# Altium schematic sheet Sheet.SchDoc
size A4
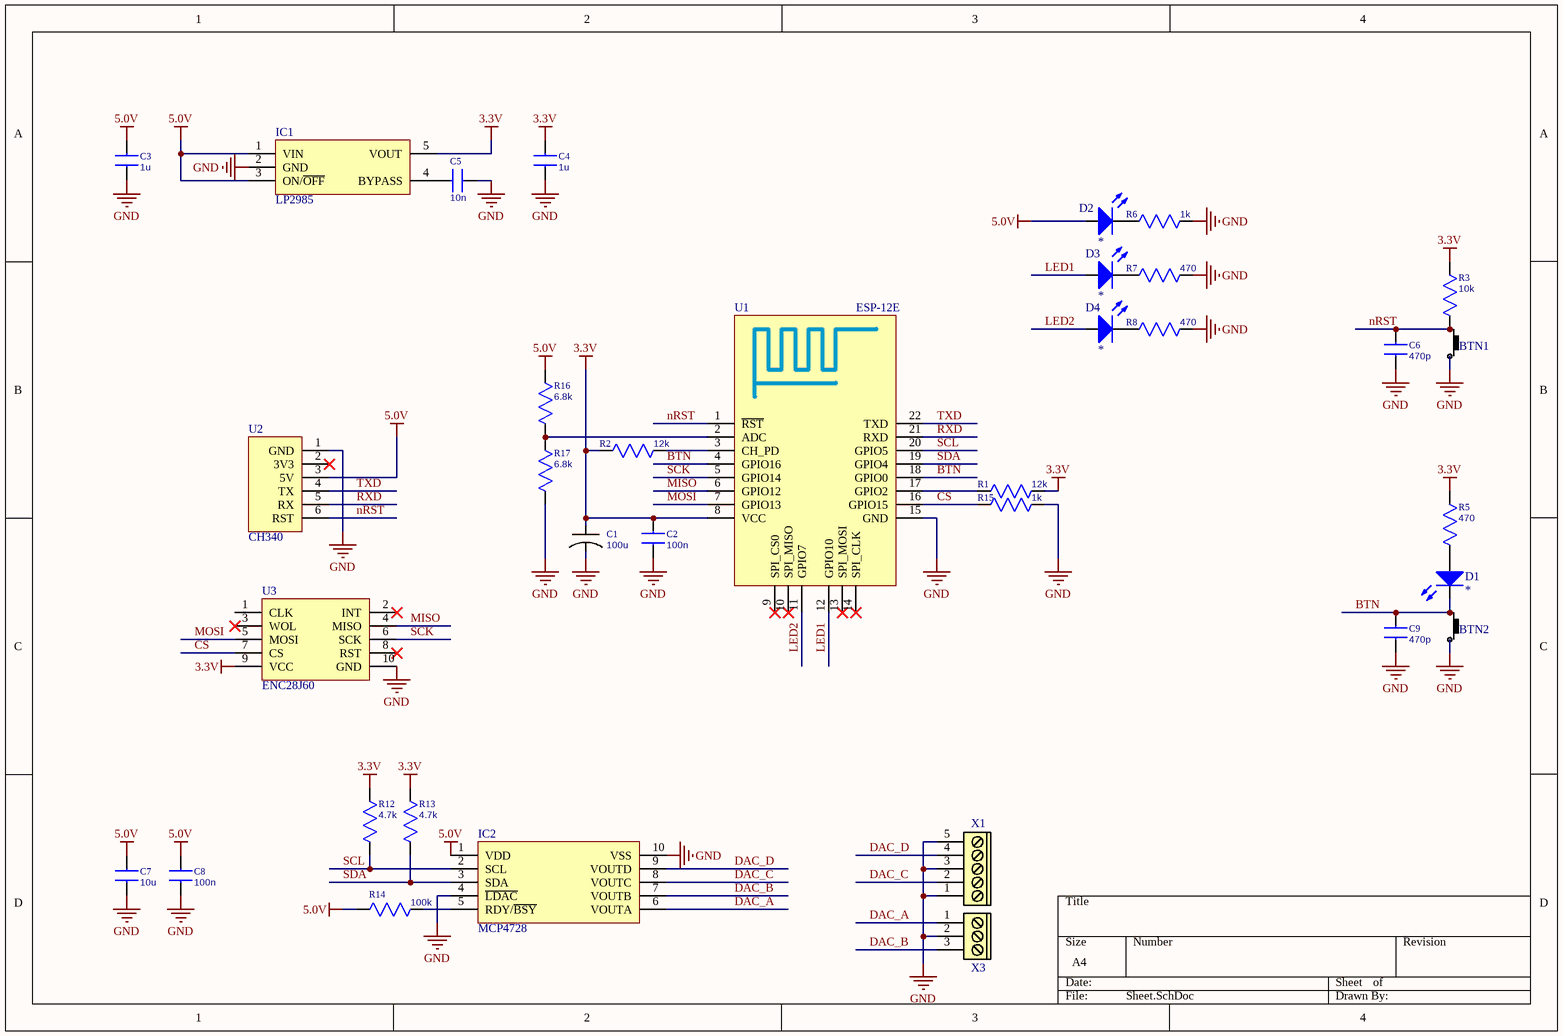
[diagram p0: Sheet.SchDoc]

## Parts
BTN1  Push Button  [PUSH BUTTON RIGHT ANGLE]  (value not drawn)
BTN2  Push Button  [PUSH BUTTON RIGHT ANGLE]  (value not drawn)
C1  100u  [R79]
C2  100n  [C_0603]
C3  1u  [C_0805]
C4  1u  [C_0805]
C5  10n  [C_0603]
C6  470p  [C_0603]
C7  10u  [C_0805]
C8  100n  [C_0603]
C9  470p  [C_0603]
D1  *  [LED_5mm]
D2  *  [LED_5mm]
D3  *  [LED_5mm]
D4  *  [LED_5mm]
IC1  LP2985  [SOT23-5]
IC2  MCP4728  [MSOP-10]
R1  12k  [R_0603]
R2  12k  [R_0603]
R3  10k  [R_0603]
R5  470  [R_0603]
R6  1k  [R_0603]
R7  470  [R_0603]
R8  470  [R_0603]
R12  4.7k  [R_0603]
R13  4.7k  [R_0603]
R14  100k  [R_0603]
R15  1k  [R_0603]
R16  6.8k  [R_0603]
R17  6.8k  [R_0603]
U1  ESP-12E  [ESP-12E]
U2  CH340  [CH340]
U3  ENC28J60  [ENC28J60]
X1  DG-300-5  [2EDGR-5.08-05P]  (value not drawn)
X3  DG-300-3  [2EDGR-5.08-03P]  (value not drawn)

## Nets
3.3V: C1.1 C2.1 C4.2 IC1.5(VOUT) R1.1 R2.2 R3.1 R5.1 R12.1 R13.1 U1.8(VCC) U3.9(VCC)
5.0V: C3.2 C7.2 C8.1 D2.1(A) IC1.1(VIN) IC1.3(ON/~{OFF}) IC2.1(VDD) R14.1 R16.2 U2.3(5V)
GND: BTN1.2 BTN2.1 C1.2 C2.2 C3.1 C4.1 C5.1 C6.1 C7.1 C8.2 C9.1 IC1.2(GND) IC2.4(~{LDAC}) IC2.10(VSS) R6.1 R7.1 R8.1 R15.1 R17.1 U1.15(GND) U2.1(GND) U3.10(GND) X1.1 X1.3 X1.5 X3.2
BTN: BTN2.2 C9.2 D1.2(K) U1.4(GPIO16) U1.18(GPIO0)
CS: R15.2 U1.16(GPIO15) U3.7(CS)
DAC_A: IC2.6(VOUTA) X3.1
DAC_B: IC2.7(VOUTB) X3.3
DAC_C: IC2.8(VOUTC) X1.2
DAC_D: IC2.9(VOUTD) X1.4
LED1: D3.1(A) U1.12(GPIO10)
LED2: D4.1(A) U1.11(GPIO7)
MISO: U1.6(GPIO12) U3.4(MISO)
MOSI: U1.7(GPIO13) U3.5(MOSI)
nRST: BTN1.1 C6.2 R3.2 U1.1(~{RST}) U2.6(RST)
RXD: U1.21(RXD) U2.5(RX)
SCK: U1.5(GPIO14) U3.6(SCK)
SCL: IC2.2(SCL) R12.2 U1.20(GPIO5)
SDA: IC2.3(SDA) R13.2 U1.19(GPIO4)
TXD: U1.22(TXD) U2.4(TX)
NetC5_2: C5.2 IC1.4(BYPASS)
NetD1_1: D1.1(A) R5.2
NetD2_2: D2.2(K) R6.2
NetD3_2: D3.2(K) R7.2
NetD4_2: D4.2(K) R8.2
NetIC2_5: IC2.5(RDY/~{BSY}) R14.2
NetR1_2: R1.2 U1.17(GPIO2)
NetR2_1: R2.1 U1.3(CH_PD)
NetR16_1: R16.1 R17.2 U1.2(ADC)

Not connected (* = marked no-connect by the designer): U1 9(SPI_CS0)* 10(SPI_MISO)* 13(SPI_MOSI)* 14(SPI_CLK)*; U2 2(3V3)*; U3 1(CLK) 2(INT)* 3(WOL)* 8(RST)*

## Library data of the parts
C1 = Electrolit: Electrolit capasitor; Value: 100u
C2 C5 C6 C8 C9 = C0603: Capacitor
  C2 C8: Value: 100n
  C5: Value: 10n
  C6 C9: Value: 470p
C3 C4 C7 = C0805: Capacitor
  C3 C4: Value: 1u
  C7: Value: 10u
D1-D4 = LED_5mm: Typical INFRARED GaAs LED; Value: *; Color: *
IC1 = LP2985: 150-mA Low-noise Low-dropout Regulator With Shutdown; Link: https://www.rcscomponents.kiev.ua/product/lp2985a-33dbvr_31082.html
IC2 = MCP4728: 12-Bit, Quad Digital-to-Analog Converter with EEPROM Memory
R1-R3 R5-R8 R12-R17 = R0603: Resistor
  R1 R2: Value: 12k
  R3: Value: 10k
  R5 R7 R8: Value: 470
  R6 R15: Value: 1k
  R12 R13: Value: 4.7k
  R14: Value: 100k
  R16 R17: Value: 6.8k
U1 = ESP-12E: WiFi Module
U2 = CH340: USB to TTL UART CH340
U3 = ENC28J60: ENC28J60 mini Ethernet module